# Altium schematic sheet interface.SchDoc
size 420 x 297 mm; SheetNumber: 2; SheetTotal: 4
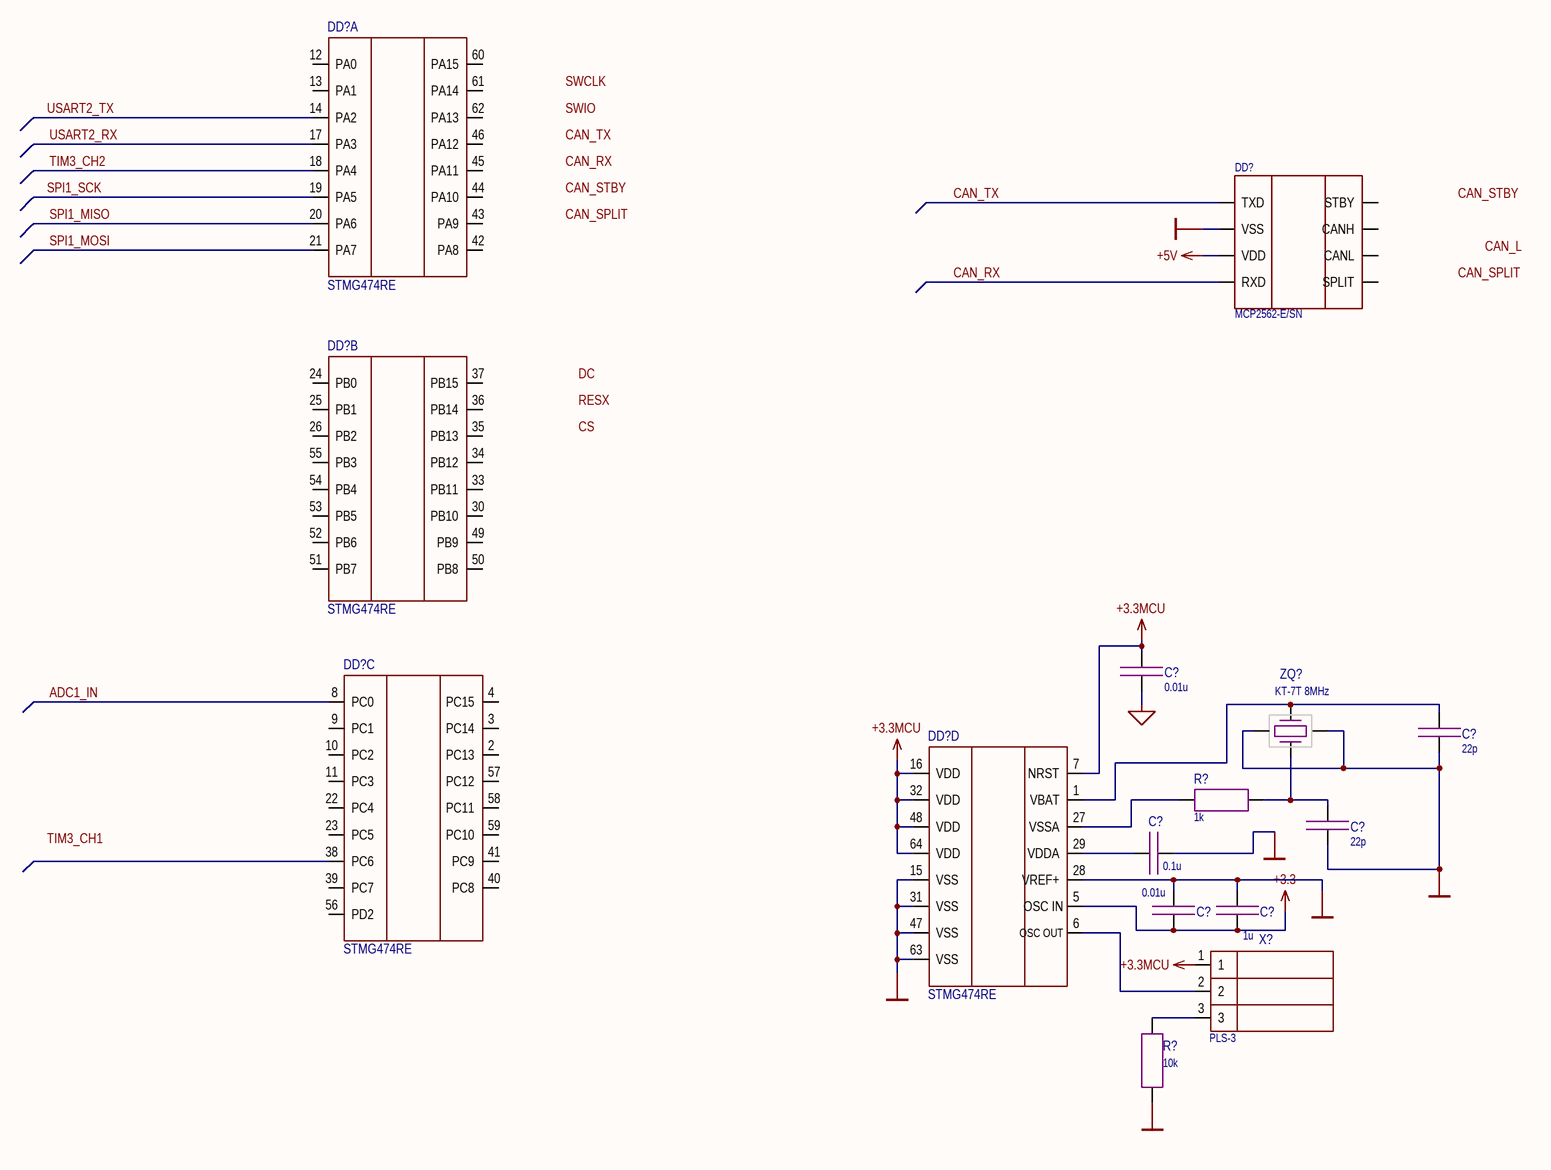
[diagram p0: interface.SchDoc]

## Parts
(Parts that share a designator on the sheet are numbered #1, #2 ... from top to bottom, then left to right.)
C?#1  0.01u  [CAP: SMD 0603 MD IPC 782]
C?#2  22p  [CAP: SMD 0603 MD IPC 782]
C?#3  22p  [CAP: SMD 0603 MD IPC 782]
C?#4  0.1u  [CAP: SMD 0603 MD IPC 782]
C?#5  0.01u  [CAP: SMD 0603 MD IPC 782]
C?#6  1u  [CAP: SMD 0603 MD IPC 782]
DD?#1  STMG474RE  [LQFP-64]  (part A of 4)
DD?#2  MCP2562-E/SN
DD?#3  STMG474RE  [LQFP-64]  (part B of 4)
DD?#4  STMG474RE  [LQFP-64]  (part C of 4)
DD?#5  STMG474RE  [LQFP-64]  (part D of 4)
R?#1  1k  [RES: SMD 0603 MD IPC 782]
R?#2  10k  [RES: SMD 0603 MD IPC 782]
X?  PLS-3  [CON: 3pin PLS-3]
ZQ?  KT-7T 8MHz  [CRYSTAL: 3225 4pin]

## Nets
+3.3: C?#5.2 C?#6.2 DD?#5.5(OSC_IN)
+3.3MCU: C?#1.1 DD?#5.7(NRST) DD?#5.16(VDD) DD?#5.32(VDD) DD?#5.48(VDD) DD?#5.64(VDD) X?.1
+5V: DD?#2.3(VDD)
GNDD: C?#2.2 C?#3.2 C?#4.1 C?#5.1 C?#6.1 DD?#2.2(VSS) DD?#5.15(VSS) DD?#5.28(VREF+) DD?#5.31(VSS) DD?#5.47(VSS) DD?#5.63(VSS) R?#2.1 ZQ?.2 ZQ?.4
ADC1_IN: DD?#4.8(PC0)
CAN_RX: DD?#2.4(RXD)
CAN_TX: DD?#2.1(TXD)
SPI1_MISO: DD?#1.20(PA6)
SPI1_MOSI: DD?#1.21(PA7)
SPI1_SCK: DD?#1.19(PA5)
TIM3_CH2: DD?#1.18(PA4)
USART2_RX: DD?#1.17(PA3)
USART2_TX: DD?#1.14(PA2)
NetC?#2_1: C?#2.1 DD?#5.1(VBAT) ZQ?.3
NetC?#3_1: C?#3.1 R?#1.2 ZQ?.1
NetC?#4_2: C?#4.2 DD?#5.29(VDDA)
NetDD?#5_6: DD?#5.6(OSC_OUT) X?.2
NetDD?#5_27: DD?#5.27(VSSA) R?#1.1
NetR?#2_2: R?#2.2 X?.3

Not connected (* = marked no-connect by the designer): C?#1 2; DD?#1 12(PA0) 13(PA1) 42(PA8) 43(PA9) 44(PA10) 45(PA11) 46(PA12) 60(PA15) 61(PA14) 62(PA13); DD?#2 5(STBY) 6(CANH) 7(CANL) 8(SPLIT); DD?#3 24(PB0) 25(PB1) 26(PB2) 30(PB10) 33(PB11) 34(PB12) 35(PB13) 36(PB14) 37(PB15) 49(PB9) 50(PB8) 51(PB7) 52(PB6) 53(PB5) 54(PB4) 55(PB3); DD?#4 2(PC13) 3(PC14) 4(PC15) 9(PC1) 10(PC2) 11(PC3) 22(PC4) 23(PC5) 38(PC6) 39(PC7) 40(PC8) 41(PC9) 56(PD2) 57(PC12) 58(PC11) 59(PC10)

## Notes on the sheet
- Labels drawn without touching a wire or pin: CAN_L, CAN_RX, CAN_SPLIT, CAN_STBY, CAN_TX, CS, DC, RESX, SWCLK, SWIO, TIM3_CH1
- Перв. примен.
- 3707.00000000 ЭИТ-1
- Справ. №
- Подп. и дата
- Инв. № дубл.
- Взам. инв. №
- Разраб.
- Изм.
- Лист
- № докум.
- Подп.
- Дата
- Лит.
- Масса
- Масштаб
- Пров.
- Т.контр.
- Листов
- Инв. № подл.
- Утв.
- Н.контр.
- 2.106-A3
- Копировал
- Формат А3

## Library data of the parts
C?#1 C?#5 = 0.01u 100V 0603 ±10%: Code: 6270003321; Name: Конденсатор СС0603KRX7R0BB104, Yageo
C?#2 C?#3 = 22p 50V 0603 ±5%: Code: 6219310401; Name: Конденсатор 0603CG220J500NT, Fenghua
C?#4 = 0.1u 50V 0603 ±10%: CC0603KRX7R9BB104; Code: 6279259871; Name: Конденсатор X7R 50V 0,1uF +-10% 0603
C?#6 = 1u 16V 0603 ±10%: Code: 62193105441; Name: Конденсатор 0603-NPO-25В-1000
DD?#1 DD?#3-DD?#5 = stmG474re: Name: Микросхема STM32F103VET6TR; Code: 6330007531
DD?#2 = MCP2562-E/SN: MCP2562-E/SN, Высокоскоростной CAN трансивер
R?#1 = 1k ±1% 0603: Code: 6069174188; Name: Резистор 1k ±1% 0603
R?#2 = 10k ±1% 0603: Code: 6069191961; Name: Резистор 10K+-1% TK50 0603
X? = 3 in PLS 3: Code: 6313952321; Name: Вилка PLS-2
ZQ? = SMD 8MHz 4pin 3.2x2.5 22pF: Code: 6329545441; Name: Резонатор кварцевый KT-7X 8.0 MHz